# EAGLE schematic receiver (EAGLE 7.7.0)
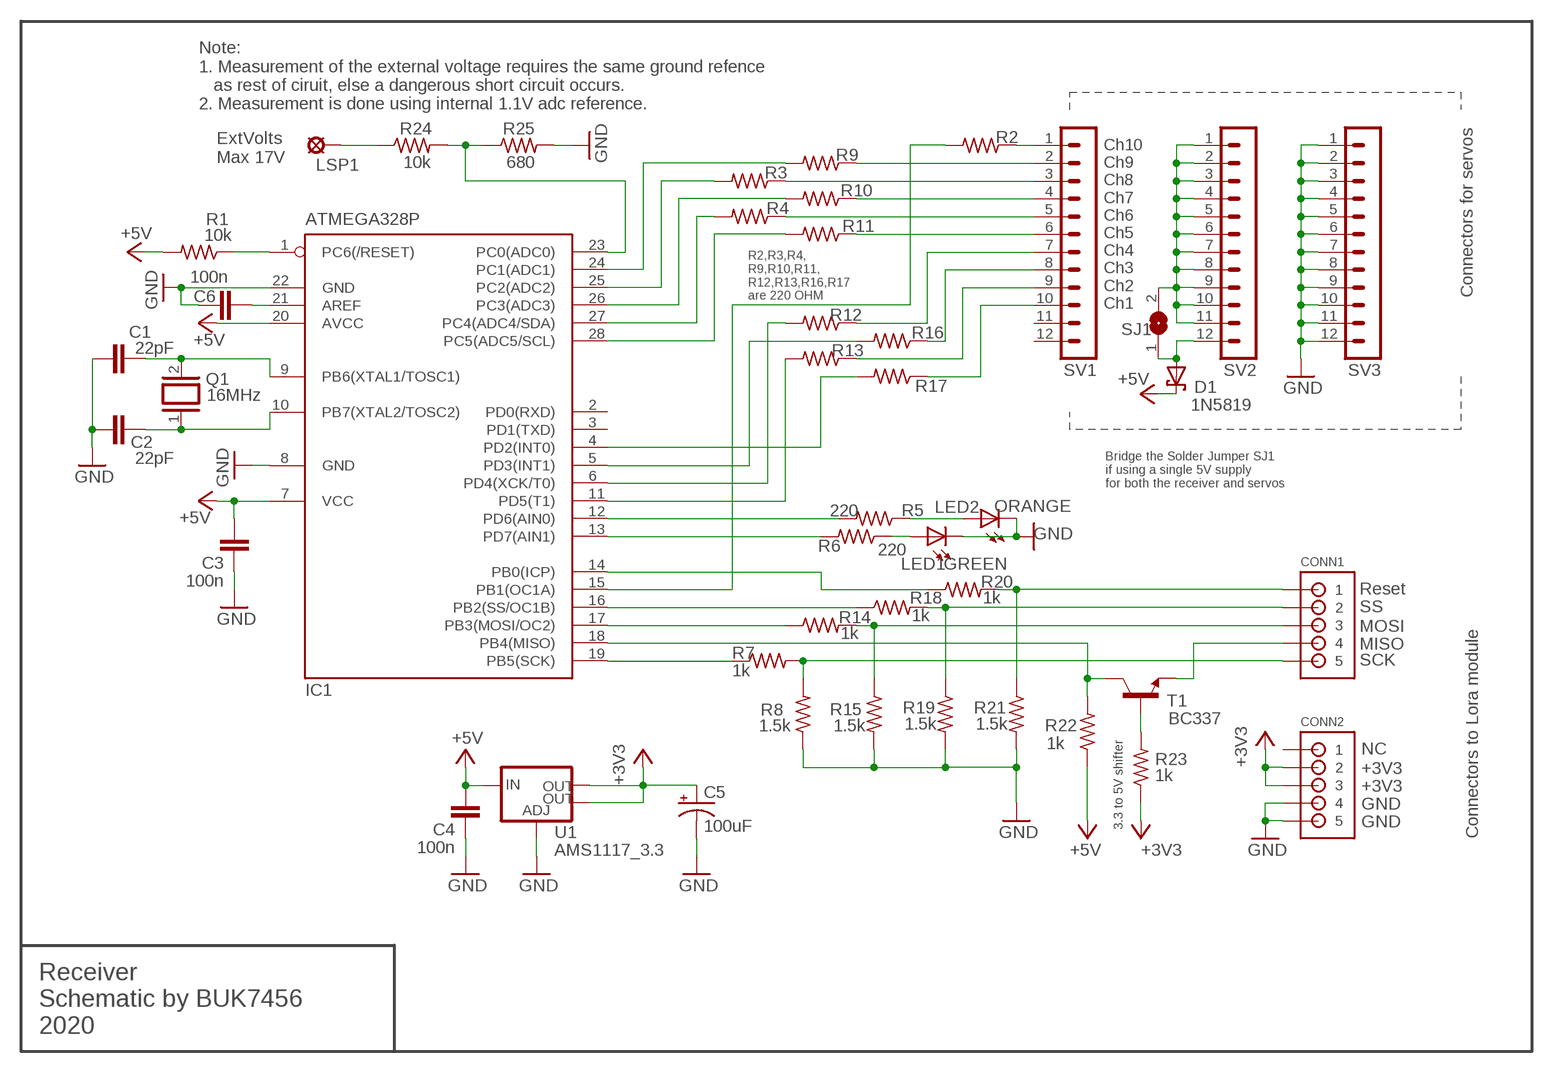
[diagram p0: schematic, sheet 1]

## Parts
C1  22pF  C-EU025-025X050  [C025-025X050]
C2  22pF  C-EU025-025X050  [C025-025X050]
C3  100n  C-EU025-025X050  [C025-025X050]
C4  100n  C-EU025-025X050  [C025-025X050]
C5  100uF  CPOL-USE2,5-6E  [E2,5-6E]
C6  100n  C-EU025-025X050  [C025-025X050]
CONN1  JST-PH_5-PIN_HEADER  [JST_B5B-PH_HEADER]
CONN2  JST-PH_5-PIN_HEADER  [JST_B5B-PH_HEADER]
D1  1N5819  1N5819-T  [DO41-7.6]
IC1  ATMEGA328P  MEGA8-P  [DIL28-3]
LED1  GREEN  LED3MM  [LED3MM]
LED2  ORANGE  LED3MM  [LED3MM]
LSP1  LSP10  [LSP10]
Q1  16MHz  XTAL/S  [QS]
R1  10k  R-US_0204/5  [0204/5]
R2  220  R-US_0204/2V  [0204V]
R3  220  R-US_0204/2V  [0204V]
R4  220  R-US_0204/2V  [0204V]
R5  220  R-US_0204/5  [0204/5]
R6  220  R-US_0204/5  [0204/5]
R7  1k  R-US_0204/5  [0204/5]
R8  1.5k  R-US_0204/2V  [0204V]
R9  220  R-US_0204/2V  [0204V]
R10  220  R-US_0204/2V  [0204V]
R11  220  R-US_0204/2V  [0204V]
R12  220  R-US_0204/2V  [0204V]
R13  220  R-US_0204/2V  [0204V]
R14  1k  R-US_0204/5  [0204/5]
R15  1.5k  R-US_0204/2V  [0204V]
R16  220  R-US_0204/2V  [0204V]
R17  220  R-US_0204/2V  [0204V]
R18  1k  R-US_0204/5  [0204/5]
R19  1.5k  R-US_0204/2V  [0204V]
R20  1k  R-US_0204/5  [0204/5]
R21  1.5k  R-US_0204/2V  [0204V]
R22  1k  R-US_0204/7  [0204/7]
R23  1k  R-US_0204/5  [0204/5]
R24  10k  R-US_0204/5  [0204/5]
R25  680  R-US_0204/5  [0204/5]
SJ1  SJ  [SJ]
SV1  MA12-1  [MA12-1]
SV2  MA12-1  [MA12-1]
SV3  MA12-1  [MA12-1]
T1  BC337  [TO92]
U1  AMS1117_3.3  V_REG_LM1117SOT223  [SOT223]

## Nets
+3V3: C5.+ CONN2.P2 CONN2.P3 R23.1 U1.2(OUT) U1.4(OUT)
+5V: C3.2 C4.2 D1.C IC1.7(VCC) IC1.20(AVCC) R1.2 R22.1 U1.3(IN)
EXT_V_MAX_17V: LSP1.MP R24.1
GND: C1.1 C2.1 C3.1 C4.1 C5.- C6.2 CONN2.P4 CONN2.P5 IC1.8(GND) IC1.22(GND) LED1.K(C) LED2.K(C) R8.1 R15.2 R19.2 R21.2 R25.2 SV3.1 SV3.2 SV3.3 SV3.4 SV3.5 SV3.6 SV3.7 SV3.8 SV3.9 SV3.10 SV3.11 SV3.12 U1.1(ADJ)
MISO: IC1.18(PB4(MISO)) R22.2 T1.3(C)
N$1: IC1.15(PB1(OC1A)) R2.2
N$2: IC1.24(PC1(ADC1)) R9.2
N$3: IC1.25(PC2(ADC2)) R3.2
N$4: IC1.26(PC3(ADC3)) R10.2
N$5: IC1.27(PC4(ADC4/SDA)) R4.2
N$6: IC1.28(PC5(ADC5/SCL)) R11.2
N$7: R2.1 SV1.1
N$8: R3.1 SV1.3
N$9: R9.1 SV1.2
N$10: R10.1 SV1.4
N$11: R4.1 SV1.5
N$12: R11.1 SV1.6
N$13: IC1.4(PD2(INT0)) R17.2
N$14: IC1.5(PD3(INT1)) R16.2
N$15: R12.1 SV1.7
N$16: C1.2 IC1.9(PB6(XTAL1/TOSC1)) Q1.2
N$17: C2.2 IC1.10(PB7(XTAL2/TOSC2)) Q1.1
N$18: R16.1 SV1.8
N$19: R17.1 SV1.10
N$20: IC1.6(PD4(XCK/T0)) R12.2
N$21: SJ1.2 SV2.1 SV2.2 SV2.3 SV2.4 SV2.5 SV2.6 SV2.7 SV2.8 SV2.9 SV2.10 SV2.11
N$22: LED2.A R5.1
N$23: IC1.11(PD5(T1)) R13.2
N$24: IC1.16(PB2(SS/OC1B)) R18.1
N$25: R13.1 SV1.9
N$26: LED1.A R6.1
N$27: IC1.12(PD6(AIN0)) R5.2
N$28: CONN1.P4 T1.1(E)
N$29: IC1.13(PD7(AIN1)) R6.2
N$30: C6.1 IC1.21(AREF)
N$31: IC1.23(PC0(ADC0)) R24.2 R25.1
N$33: D1.A SJ1.1 SV2.12
N$34: CONN1.P2 R18.2 R19.1
N$35: IC1.17(PB3(MOSI/OC2)) R14.1
N$36: R23.2 T1.2(B)
N$37: IC1.14(PB0(ICP)) R20.1
N$38: CONN1.P1 R20.2 R21.1
N$40: CONN1.P3 R14.2 R15.1
N$41: IC1.19(PB5(SCK)) R7.1
N$42: CONN1.P5 R7.2 R8.2
RST: IC1.1(PC6(/RESET)) R1.1
Unconnected: CONN2.P1 IC1.2(PD0(RXD)) IC1.3(PD1(TXD)) SV1.11 SV1.12

## Notes on the sheet
- Note: 
  1. Measurement of the external voltage requires the same ground refence
     as rest of ciruit, else a dangerous short circuit occurs. 
  2. Measurement is done using internal 1.1V adc reference.
- Connectors for servos
- ExtVolts
  Max 17V
- R2,R3,R4,
  R9,R10,R11,
  R12,R13,R16,R17
  are 220 OHM
- Ch10
  Ch9
  Ch8
  Ch7
  Ch6
  Ch5
  Ch4
  Ch3
  Ch2
  Ch1
- Bridge the Solder Jumper SJ1
  if using a single 5V supply
  for both the receiver and servos
- Reset
- SS
- MOSI
- MISO
- SCK
- NC
- +3V3
- +3V3
- GND
- 3.3 to 5V shifter | GND
- Connectors to Lora module
- Receiver
  Schematic by BUK7456
  2020

## Library data of the parts
C1-C4 C6 = rcl:C-EU: CAPACITOR, European symbol
C5 = rcl:CPOL-US: POLARIZED CAPACITOR, American symbol
CONN1 CONN2 = SRGmod:JST-PH_5-PIN_HEADER: 5-pin JST PH Shrouded Header, top entry P/N B5B-PH-K-S Mating connector PHR-5 Mating cable assembly: Sparkfun PRT-09917 <http://www.sparkfun.com/products/9917>
D1 = diode:1N581*: 1.0A SCHOTTKY BARRIER RECTIFIER Source: http://www.diodes.com/datasheets/ds23001.pdf
IC1 = atmel:MEGA8-P: MICROCONTROLLER 8 Kbytes FLASH, 1 kbytes SRAM, 512 bytes EEPROM, USART, 4-channel 10 bit ADC, 2-channel 8 bit ADC Pin compatible with Atmega48, ATMega88, ATMega168 Source: avr.lbr; OC_FARNELL: unknown; OC_NEWARK: unknown
LED1 LED2 = led:LED: LED OSRAM: - CHIPLED LG R971, LG N971, LY N971, LG Q971, LY Q971, LO R971, LY R971 LH N974, LH R974 LS Q976, LO Q976, LY Q976 LO Q996 - Hyper CHIPLED LW Q18S LB Q993, LB Q99A, LB R99A - SideLED LS A670, LO A670, LY A670, LG A670, LP A670 LB A673, LV A673, LT A673, LW A673 LH A674 LY A675 LS A676, LA A676, LO A676, LY A676, LW A676 LS A679, LY A679, LG A679 - Hyper Micro SIDELED® LS Y876, LA Y876, LO Y876, LY Y876 LT Y87S - SmartLED LW L88C, LW L88S LB L89C, LB L89S, LG L890 LS L89K, LO L89K, LY L89K LS L896, LA L896, LO L896, LY L896 - TOPLED LS T670, LO T670, LY T670, LG T670, LP T670 LSG T670, LSP T670, LSY T670, LOP T670, LYG T670 LG T671, LOG T671, LSG T671 LB T673, LV T673, LT T673, LW T673 LH T674 LS T676, LA T676, LO T676, LY T676, LB T676, LH T676, LSB T676, LW T676 LB T67C, LV T67C, LT T67C, LS T67K, LO T67K, LY T67K, LW E67C LS E67B, LA E67B, LO E67B, LY E67B, LB E67C, LV E67C, LT E67C LW T67C LS T679, LY T679, LG T679 LS T770, LO T770, LY T770, LG T770, LP T770 LB T773, LV T773, LT T773, LW T773 LH T774 LS E675, LA E675, LY E675, LS T675 LS T776, LA T776, LO T776, LY T776, LB T776 LHGB T686 LT T68C, LB T68C - Hyper Mini TOPLED® LB M676 - Mini TOPLED Santana® LG M470 LS M47K, LO M47K, LY M47K Source: http://www.osram.convergy.de LUXEON: - LUMILED® LXK2-PW12-R00, LXK2-PW12-S00, LXK2-PW14-U00, LXK2-PW14-V00 LXK2-PM12-R00, LXK2-PM12-S00, LXK2-PM14-U00 LXK2-PE12-Q00, LXK2-PE12-R00, LXK2-PE12-S00, LXK2-PE14-T00, LXK2-PE14-U00 LXK2-PB12-K00, LXK2-PB12-L00, LXK2-PB12-M00, LXK2-PB14-N00, LXK2-PB14-P00, LXK2-PB14-Q00 LXK2-PR12-L00, LXK2-PR12-M00, LXK2-PR14-Q00, LXK2-PR14-R00 LXK2-PD12-Q00, LXK2-PD12-R00, LXK2-PD12-S00 LXK2-PH12-R00, LXK2-PH12-S00 LXK2-PL12-P00, LXK2-PL12-Q00, LXK2-PL12-R00 Source: www.luxeon.com KINGBRIGHT: KA-3528ASYC Source: www.kingbright.com
LSP1 = solpad:LSP10: SOLDER PAD drill 1.0 mm, distributor Buerklin, 12H555
Q1 = special:XTAL/S: CRYSTAL
R1-R25 = rcl:R-US_: RESISTOR, American symbol
SJ1 = jumper:SJ: SMD solder JUMPER
SV1-SV3 = con-lstb:MA12-1: PIN HEADER; OC_FARNELL: unknown; OC_NEWARK: unknown
T1 = transistor:BC337: NPN TRANSISTOR
U1 = SparkFun-PowerIC:V_REG_LM1117: Voltage Regulator LM1117 Standard adjustable voltage regulator but in SMD form. Spark Fun Electronics SKU : COM-00595; PROD_ID: VREG-08170